# EAGLE schematic Becca Sap Flow Sensor MOD2 (EAGLE 9.6.2)
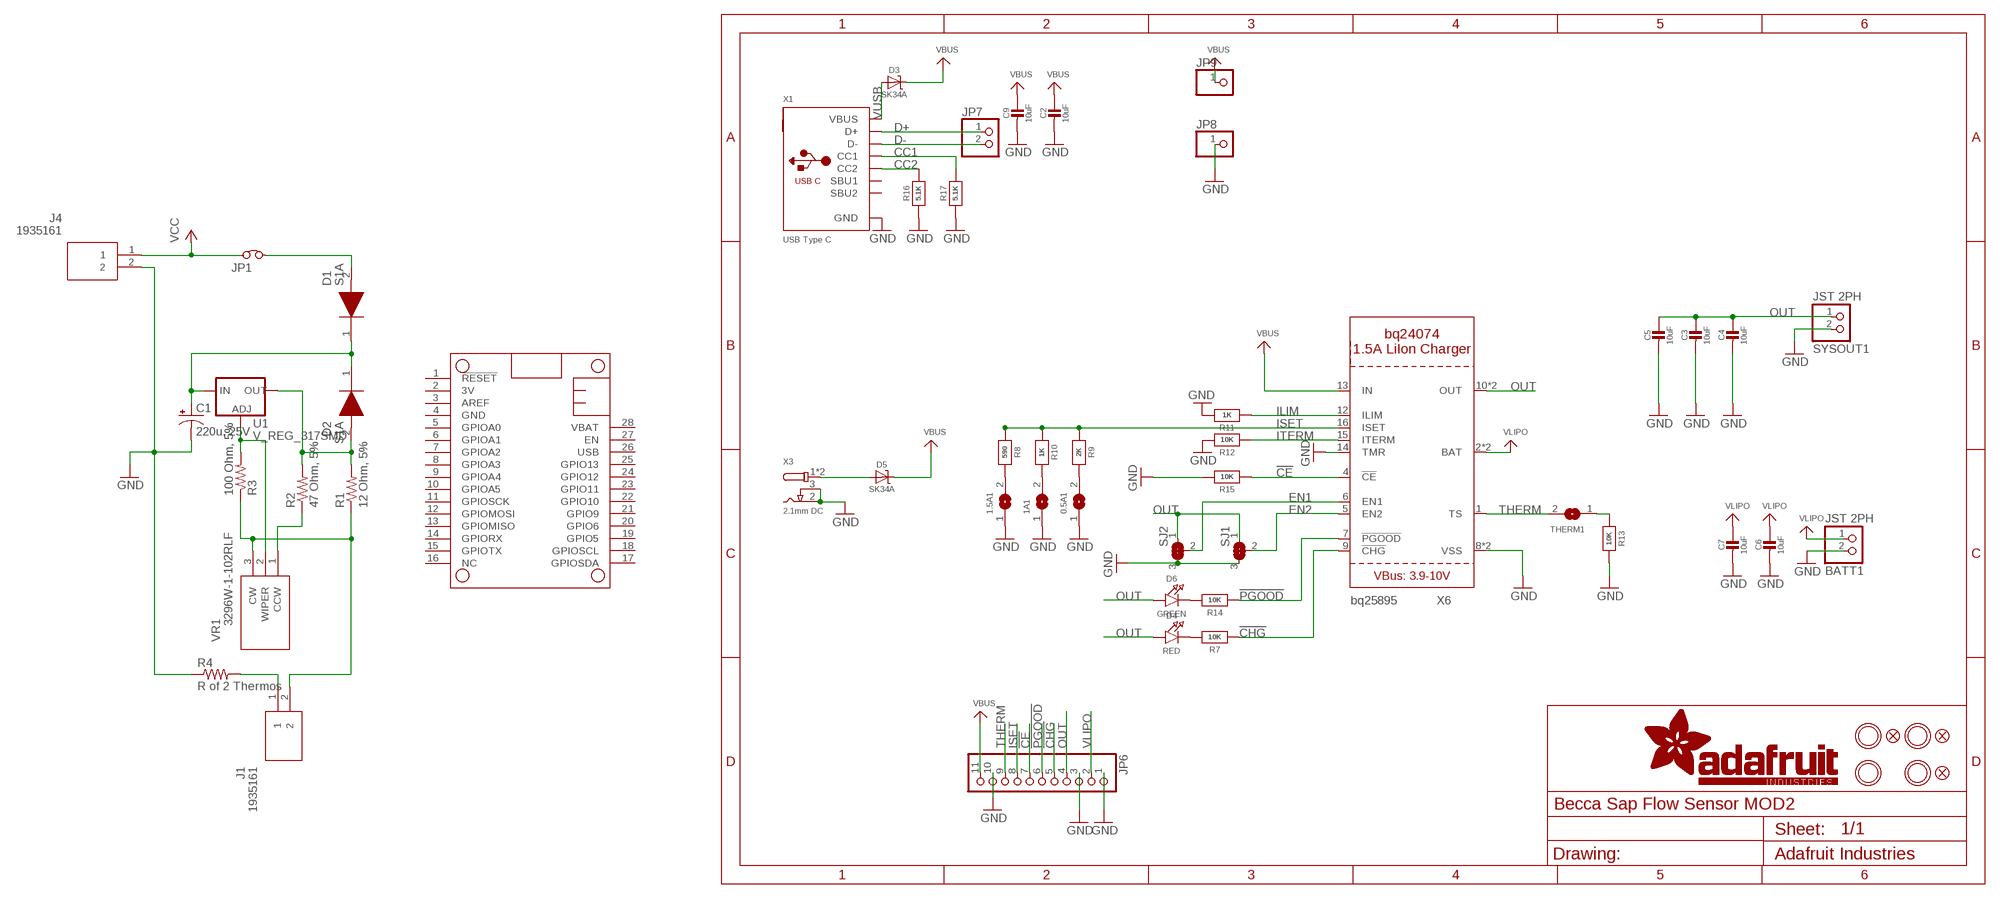
[diagram p0: schematic, sheet 1]

## Parts
0.5A1  SOLDERJUMPER  [SOLDERJUMPER_ARROW_NOPASTE]
1.5A1  SOLDERJUMPER  [SOLDERJUMPER_ARROW_NOPASTE]
1A1  SOLDERJUMPERCLOSED  [SOLDERJUMPER_CLOSEDWIRE]
BATT1  JST 2PH  JST_2PIN-SMT-RA  [JST-PH-2-SMT-RA]
C1  220u, 25V  CPOL-USC  [PANASONIC_C]
C2  10uF  CAP_CERAMIC0805-NOOUTLINE  [0805-NO]
C3  10uF  CAP_CERAMIC0805-NOOUTLINE  [0805-NO]
C4  10uF  CAP_CERAMIC0805-NOOUTLINE  [0805-NO]
C5  10uF  CAP_CERAMIC0805-NOOUTLINE  [0805-NO]
C6  10uF  CAP_CERAMIC0805-NOOUTLINE  [0805-NO]
C7  10uF  CAP_CERAMIC0805-NOOUTLINE  [0805-NO]
C9  10uF  CAP_CERAMIC0805-NOOUTLINE  [0805-NO]
D1  S1A  [DIOM5027X250N]
D2  S1A  [DIOM5027X250N]
D3  SK34A  DIODE-SCHOTTKYSMA  [SMADIODE]
D4  RED  LED0603  [CHIPLED_0603]
D5  SK34A  DIODE-SCHOTTKYSMA  [SMADIODE]
D6  GREEN  LED0603  [CHIPLED_0603]
FID1  FIDUCIAL_1MM  [FIDUCIAL_1MM]
FID2  FIDUCIAL_1MM  [FIDUCIAL_1MM]
FID3  FIDUCIAL_1MM  [FIDUCIAL_1MM]
J1  1935161  [1935161]
J4  1935161  [1935161]
JP1  JUMPER  [HDR2X1]
JP6  HEADER-1X1176MIL  [1X11_ROUND_76]
JP7  HEADER-1X2ROUND  [1X02_ROUND]
JP8  HEADER-1X1  [1X01_OVAL]
JP9  HEADER-1X1  [1X01_OVAL]
MS1  FEATHERWING  [FEATHERWING]
R1  12 Ohm, 5%  R-US_R0805  [R0805]
R2  47 Ohm, 5%  R-US_R0805  [R0805]
R3  100 Ohm, 5%  R-US_R0805  [R0805]
R4  R of 2 Thermos  R-US_R0805  [R0805]
R7  10K  RESISTOR_0603_NOOUT  [0603-NO]
R8  590  RESISTOR_0603_NOOUT  [0603-NO]
R9  2K  RESISTOR_0603_NOOUT  [0603-NO]
R10  1K  RESISTOR_0603_NOOUT  [0603-NO]
R11  1K  RESISTOR_0603_NOOUT  [0603-NO]
R12  10K  RESISTOR_0603_NOOUT  [0603-NO]
R13  10K  RESISTOR_0603_NOOUT  [0603-NO]
R14  10K  RESISTOR_0603_NOOUT  [0603-NO]
R15  10K  RESISTOR_0603_NOOUT  [0603-NO]
R16  5.1K  RESISTOR_0603_NOOUT  [0603-NO]
R17  5.1K  RESISTOR_0603_NOOUT  [0603-NO]
SJ1  SOLDERJUMPER_2WAY  [SOLDERJUMPER_2WAY_OPEN_NOPASTE]
SJ2  SOLDERJUMPER_2WAY  [SOLDERJUMPER_2WAY_OPEN_NOPASTE]
SYSOUT1  JST 2PH  JST_2PIN-SMT-RA  [JST-PH-2-SMT-RA]
THERM1  SOLDERJUMPERCLOSED  [SOLDERJUMPER_CLOSEDWIRE]
U1  V_REG_317SMD  [SOT223]
U$3  MOUNTINGHOLE2.5  [MOUNTINGHOLE_2.5_PLATED]
U$4  MOUNTINGHOLE2.5  [MOUNTINGHOLE_2.5_PLATED]
U$11  MOUNTINGHOLE2.5  [MOUNTINGHOLE_2.5_PLATED]
U$12  MOUNTINGHOLE2.5  [MOUNTINGHOLE_2.5_PLATED]
VR1  3296W-1-102RLF  [3296W1102RLF]
X1  USB Type C  USB_C  [USB_C_CUSB31-CFM2AX-01-X]
X3  2.1mm DC  DCBARRELSMT  [DCJACK_2MM_SMT]
X6  BQ24074  [QFN16_3MM]

## Nets
!CE: JP6.7 R15.1 X6.4(!CE)
!CHG: JP6.5 R7.1 X6.9(!CHG)
!PGOOD: JP6.6 R14.1 X6.7(!PGOOD)
CC1: R17.2 X1.A5(CC1)
CC2: R16.2 X1.B5(CC2)
D+: JP7.1 X1.A6(D+) X1.B6(D+)
D-: JP7.2 X1.A7(D-) X1.B7(D-)
EN1: SJ2.2 X6.6(EN1)
EN2: SJ1.2 X6.5(EN2)
GND: 0.5A1.1 1.5A1.1 1A1.1 BATT1.2 C1.- C2.2 C3.2 C4.2 C5.2 C6.2 C7.2 C9.2 J4.2 JP6.1 JP6.3 JP6.10 JP8.1 R4.1 R11.2 R12.2 R13.2 R15.2 R16.1 R17.1 SJ1.3 SJ2.3 SYSOUT1.2 X1.A1B12(GND) X1.B1A12(GND) X3.2(GND) X3.3(GNDBREAK) X6.8(VSS) X6.14(TMR) X6.THERMAL(VSS)
ILIM: R11.1 X6.12(ILIM)
ISET: JP6.8 R8.1 R9.1 R10.1 X6.16(ISET)
ITERM: R12.1 X6.15(ITERM)
N$1: D1.2(A) JP1.2
N$2: C1.+ D1.1(K) D2.1(K) U1.3(IN)
N$3: D5.A X3.1'(PWR) X3.1(PWR)
N$4: D2.2(A) R1.2 R2.2 U1.2(OUT)
N$5: 1.5A1.2 R8.2
N$6: J1.1 R4.2
N$7: 0.5A1.2 R9.2
N$8: 1A1.2 R10.2
N$9: R3.2 U1.1(ADJ) VR1.2(WIPER)
N$10: R2.1 VR1.1(CCW)
N$11: J1.2 R1.1 R3.1 VR1.3(CW)
N$12: D4.C R7.2
N$13: D6.C R14.2
N$14: R13.1 THERM1.1
OUT: C3.1 C4.1 C5.1 D4.A D6.A JP6.4 SJ1.1 SJ2.1 SYSOUT1.1 X6.10(OUT) X6.11(OUT)
THERM: JP6.9 THERM1.2 X6.1(TS)
VBUS: C2.1 C9.1 D3.C D5.C JP6.11 JP9.1 X6.13(IN)
VCC: J4.1 JP1.1
VLIPO: BATT1.1 C6.1 C7.1 JP6.2 X6.2(BAT) X6.3(BAT)
VUSB: D3.A X1.A4B9(VBUS) X1.B4A9(VBUS)
Unconnected: MS1.1(!RESET) MS1.2(3V) MS1.3(AREF) MS1.5(GPIOA0) MS1.6(GPIOA1) MS1.7(GPIOA2) MS1.8(GPIOA3) MS1.9(GPIOA4) MS1.10(GPIOA5) MS1.11(GPIOSCK) MS1.12(GPIOMOSI) MS1.13(GPIOMISO) MS1.14(GPIORX) MS1.15(GPIOTX) MS1.16(NC) MS1.17(GPIOSDA) MS1.18(GPIOSCL) MS1.19(GPIO5) MS1.20(GPIO6) MS1.21(GPIO9) MS1.22(GPIO10) MS1.23(GPIO11) MS1.24(GPIO12) MS1.25(GPIO13) MS1.26(USB) MS1.27(EN) MS1.28(VBAT) X1.A8(SBU1) X1.B8(SBU2)

## Power pins joined to a net without a drawn wire
GND: MS1.4(GND)

## Library data of the parts
0.5A1 1.5A1 = microbuilder:SOLDERJUMPER: SMD Solder JUMPER Solder the two pads together to create a connection, or remove the solder to break it. REFLOW - Use this footprint for solder paste and reflow ovens. WAVE - Use this footprint for hand-soldering (larger pads). CLOSED - Has a trace between the two pads to ensure it is closed by default. The trace needs to be cut to disable the jumper, and can be closed again by creating a solder bridge between the two pads.; BOM: EXCLUDE
1A1 THERM1 = microbuilder:SOLDERJUMPER: SMD Solder JUMPER Solder the two pads together to create a connection, or remove the solder to break it. REFLOW - Use this footprint for solder paste and reflow ovens. WAVE - Use this footprint for hand-soldering (larger pads). CLOSED - Has a trace between the two pads to ensure it is closed by default. The trace needs to be cut to disable the jumper, and can be closed again by creating a solder bridge between the two pads.
BATT1 SYSOUT1 = adafruit:JST_2PIN: JST 2-Pin Connectors of various flavors SMT-RA (S2B-PH-SM4) 4UConnector #17311 SMT (B2B-PH-SM4) THM-RA (S2B-PH) THM (B2B-PH)
C1 = rcl:CPOL-US: POLARIZED CAPACITOR, American symbol; SPICEPREFIX: C
C2-C7 C9 = microbuilder:CAP_CERAMIC: Ceramic Capacitors For new designs, use the packages preceded by an '_' character since they are more reliable: The following footprints should be used on most boards: _0402 - Standard footprint for regular board layouts _0603 - Standard footprint for regular board layouts _0805 - Standard footprint for regular board layouts _1206 - Standard footprint for regular board layouts For extremely tight-pitch boards where space is at a premium, the following 'micro-pitch' footprints can be used (smaller pads, no silkscreen outline, etc.): _0402MP - Micro-pitch footprint for very dense/compact boards _0603MP - Micro-pitch footprint for very dense/compact boards _0805MP - Micro-pitch footprint for very dense/compact boards _1206MP - Micro-pitch footprint for very dense/compact boards
D1 D2 = S1A:S1A: Rectifier Diode Switching 50V 1A 1500ns 2-Pin SMA T/R Source: Datasheet <https://diotec.com/request/datasheet/s1a.pdf>; DESCRIPTION: Rectifier Diode Switching 50V 1A 1500ns 2-Pin SMA T/R; HEIGHT: 2.5mm; MANUFACTURER_NAME: Diotec; MANUFACTURER_PART_NUMBER: S1A; MOUSER_PART_NUMBER: 637-S1A; MOUSER_PRICE-STOCK: https://www.mouser.co.uk/ProductDetail/Diotec-Semiconductor/S1A?qs=OlC7AqGiEDlqVjQP70PTqA%3D%3D
D3 D5 = microbuilder:DIODE-SCHOTTKY
D4 D6 = microbuilder:LED: LED 0603 - 0603 Surface Mount Package 2mA: Green LED - Low Power (3.9mcd, 2ma, 1.7Vf) - Digikey: 475-2709-2-ND Orange LED - Low Power (9.8mcd, 2ma, 1.8Vf) - Digikey: 475-1194-2-ND Red LED - Low Power (5mcd, 2ma, 1.8Vf) - Digikey: 475-1195-2-ND Yellow LED - Low Power (7mcd, 2ma, 1.8Vf) - Digikey: 475-1196-2-ND 5mA: Blue LED - Low Power (17mcd, 5ma, 2.9Vf) - Digikey: LNJ937W8CRACT-ND 0805 - 0805 Surface Mount Package 2mA: Red LED (8.8mcd, 2mA, 1.8Vf, Clear) - Low Power [Digikey: 475-2510-1-ND] Green LED (5mcd, 2mA, 1.8Vf, Clear) - Low Power [Digikey: 475-2730-1-ND] Yellow LED (11.3mcd, 2mA, 1.8Vf, Clear) - Low Power [Digikey: 475-2555-1-ND] 20mA: Red LED (104mcd, 20mA, Diffused) - LS R976 [Digikey: 475-1278-6-ND] Red LED (12mcd, 20mA, 2.0Vf, Clear) - APT2012EC [Digikey: 754-1128-1-ND] Green LED (15mcd, 20mA, 2.2Vf, Clear) - APT2012GC [Digikey: 754-1131-1-ND] Orange LED (160mcd, 20mA, 2.1Vf, Clear) - APT2012SECK [Digikey: 754-1130-1-ND] 1206 - 1206 Surface Mount Package Green LED (26mcd, 20mA, Diffused) - LG N971 [Digikey: 475-1407-6-ND] Red LED (15mcd, 20mA, Diffused) - LH N974 [Digikey: 475-1416-6-ND] Cree - Cree High-Power Surface Mount LEDs XPEBWT-L1-0000-00D50 - White 111lm 350mA 2.9Vf 6200K 110° XTEAWT-00-0000-00000LEE3 - White 114lm 350mA 2.85Vf 5000K 115° Everlight - Everlight 45-21 Series Surface Mount LEDs 45-21/QK2C-B2832AC2CB2/2T - Warm White 2000mcd 20mA 3.25Vf 3050K 120° 45-21/LK2C-B38452C4CB2/2T - Nuetral White 2000mcd 20mA 3.25Vf 4150K 120° 45-21/LK2C-B50634C6CB2/2T - Cold White 2200mcd 20mA 3.25Vf 5650K 120° PLCC2 Reverse Mount LS T77K-J1L2-1-0-2-R18-Z - Red 11.25mcd 2mA 1.8Vf 630nm 120° LO T77K-L1M2-24-Z - Orange 19.6mcd 2mA 1.8Vf 606nm 120° LY T77K-K2M1-26-Z - Yellow 15.7mcd 2mA 1.8Vf 587nm 120°
FID1-FID3 = microbuilder:FIDUCIAL: Fiducial Alignment Points Various fiducial points for machine vision alignment.; BOM: EXCLUDE
J1 J4 = 1935161:1935161: Phoenix Contact COMBICON PT PCB Terminal Block, 2 Way/Pole, Screw Terminals, 26 14 AWG Through Hole, Nylon Source: Datasheet <https://datasheet.datasheetarchive.com/originals/distributors/SFDatasheet-2/sf-00057459.pdf>; DESCRIPTION: Phoenix Contact COMBICON PT PCB Terminal Block, 2 Way/Pole, Screw Terminals, 26 14 AWG Through Hole, Nylon; HEIGHT: 11.55mm; MANUFACTURER_NAME: Phoenix Contact; MANUFACTURER_PART_NUMBER: 1935161; MOUSER_PART_NUMBER: 651-1935161; MOUSER_PRICE-STOCK: https://www.mouser.co.uk/ProductDetail/Phoenix-Contact/1935161?qs=W3wJikR1%252BS6eKzfFl8Rbew%3D%3D
JP1 = 6P1_EVB:JUMPER: Wire jumper .1" C
JP6 = microbuilder:HEADER-1X11
JP7 = microbuilder:HEADER-1X2: PIN HEADER
JP8 JP9 = microbuilder:HEADER-1X1: PIN HEADER
MS1 = adafruit:FEATHERWING
R1-R4 = rcl:R-US_: RESISTOR, American symbol; SPICEPREFIX: R
R7-R17 = microbuilder:RESISTOR: Resistors For new designs, use the packages preceded by an '_' character since they are more reliable: The following footprints should be used on most boards: _0402 - Standard footprint for regular board layouts _0603 - Standard footprint for regular board layouts _0805 - Standard footprint for regular board layouts _1206 - Standard footprint for regular board layouts For extremely tight-pitch boards where space is at a premium, the following 'micro-pitch' footprints can be used (smaller pads, no silkscreen outline, etc.): _0402MP - Micro-pitch footprint for very dense/compact boards _0603MP - Micro-pitch footprint for very dense/compact boards _0805MP - Micro-pitch footprint for very dense/compact boards _1206MP - Micro-pitch footprint for very dense/compact boards
SJ1 SJ2 = microbuilder:SOLDERJUMPER_2WAY: 2-Way Solder Jumper
U1 = SparkFun-IC-Power:V_REG_317: Voltage Regulator Standard LM317 adjustable voltage regulator. AOI (Adjust Output Input). Google 'LM317 Calculator' for easy to use app to get the two resistor values needed. 240/720 for 5V output. 240/390 for 3.3V output. Spark Fun Electronics SKU : COM-00527
U$3 U$4 U$11 U$12 = microbuilder:MOUNTINGHOLE: Mounting Hole For #2 screws (0.086"/2.18mm width, 0.094"/2.4mm hole) use 2.5mm; BOM: EXCLUDE
VR1 = 3296W-1-102RLF:3296W-1-102RLF: 1 kOhms 0.5W, 1/2W PC Pins Through Hole Trimmer Potentiometer Cermet 25.0 Turn Top Adjustment Source: Datasheet <https://www.bourns.com/docs/Product-Datasheets/3296.pdf>; DESCRIPTION: 1 kOhms 0.5W, 1/2W PC Pins Through Hole Trimmer Potentiometer Cermet 25.0 Turn Top Adjustment; HEIGHT: 11.8mm; MANUFACTURER_NAME: Bourns; MANUFACTURER_PART_NUMBER: 3296W-1-102RLF; MOUSER_PART_NUMBER: 652-3296W-1-102RLF; MOUSER_PRICE-STOCK: https://www.mouser.co.uk/ProductDetail/Bourns/3296W-1-102RLF?qs=oM%2FE6%2FUWOpR5bwX1MfrWeA%3D%3D
X1 = microbuilder:USB_C: USB Type-C USB 2.0 Connector
X3 = microbuilder:DCBARREL: DC Barrel Jack DCJACK_1.3MM_PTH - Through Hole 1.3mm Jack (4UConnector: 05536) DCJACK_2MM_PTH - Through Hole 2.0/2.1 Jack (4UConnector: 05537) DCJACK_2MM_SMT - SMT 2.0/2.1mm Jack(4UConnector: 03267)
X6 = adafruit_power:BQ24074